# Altium schematic sheet Progr.SchDoc
size A4
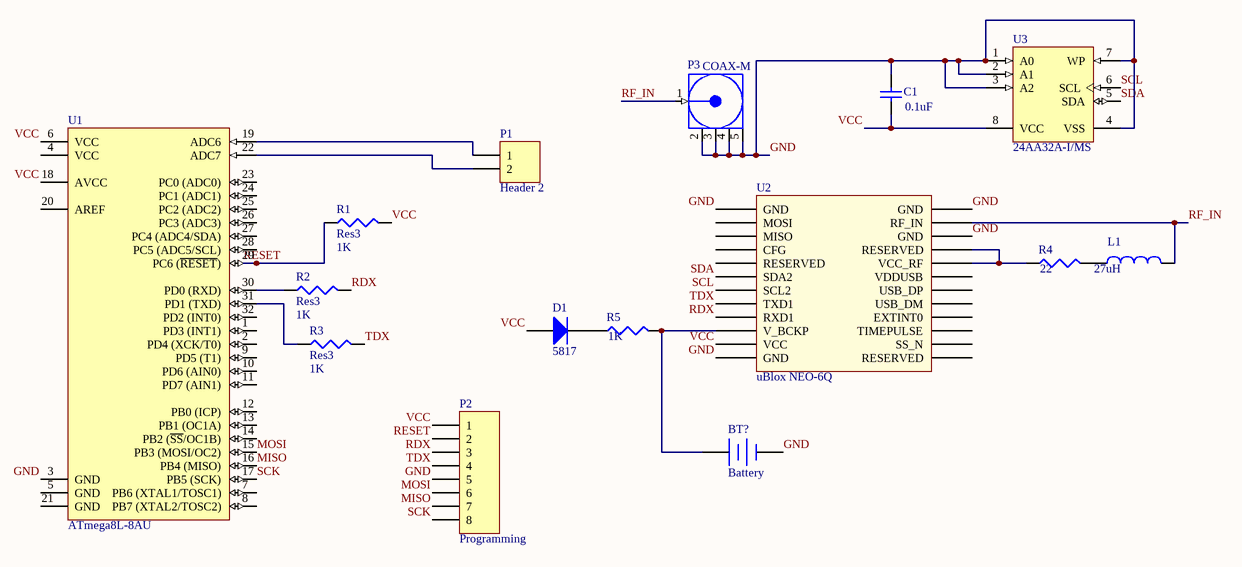
[diagram p0: Progr.SchDoc]

## Parts
BT?  Battery  [BAT-2]
C1  value 0.1uF  [C1206]  (hidden comment: Cap Semi)
D1  5817  [SMC]
L1  value 27uH  [0402-A]  (hidden comment: Inductor)
P1  Header 2  [HDR1X2]
P2  Programming  [HDR1X8]
P3  COAX-M  [MMCX2.54-V5]
R1  Res3  value 1K  [J1-0603]
R2  Res3  value 1K  [J1-0603]
R3  Res3  value 1K  [J1-0603]
R4  value 22  [J1-0603]  (hidden comment: Res3)
R5  value 1K  [J1-0603]  (hidden comment: Res3)
U1  ATmega8L-8AU  [32A_N]
U2  uBlox NEO-6Q  [NEO_6]
U3  24AA32A-I/MS  [MSOP-MS8_N]

## Nets
GND: BT?.2(-) C1.2 P2.5 P3.2(GND) P3.3(GND) P3.4(GND) P3.5(GND) U1.3(GND) U2.10(GND) U2.12(GND) U2.13(GND) U2.24(GND) U3.1(A0) U3.2(A1) U3.3(A2) U3.4(VSS) U3.7(WP)
MISO: P2.7 U1.16(PB4_(MISO))
MOSI: P2.6 U1.15(PB3_(MOSI/OC2))
RDX: P2.3 R2.2 U2.21(RXD1)
RESET: P2.2 R1.2 U1.29(PC6_(~{RESET}))
RF_IN: L1.2 P3.1(Signal) U2.11(RF_IN)
SCK: P2.8 U1.17(PB5_(SCK))
SCL: U2.19(SCL2) U3.6(SCL)
SDA: U2.18(SDA2) U3.5(SDA)
TDX: P2.4 R3.2 U2.20(TXD1)
VCC: C1.1 D1.1(A) P2.1 R1.1 U1.6(VCC) U1.18(AVCC) U2.23(VCC) U3.8(VCC)
NetBT?_1: BT?.1(+) R5.1 U2.22(V_BCKP)
NetD1_2: D1.2(K) R5.2
NetL1_1: L1.1 R4.1
NetP1_1: P1.1 U1.19(ADC6)
NetP1_2: P1.2 U1.22(ADC7)
NetR2_1: R2.1 U1.30(PD0_(RXD))
NetR3_1: R3.1 U1.31(PD1_(TXD))
NetR4_2: R4.2 U2.8(VCC_RF) U2.9(RESERVED)

Not connected (* = marked no-connect by the designer): U1 1(PD3_(INT1)) 2(PD4_(XCK/T0)) 4(VCC) 5(GND) 7(PB6_(XTAL1/TOSC1)) 8(PB7_(XTAL2/TOSC2)) 9(PD5_(T1)) 10(PD6_(AIN0)) 11(PD7_(AIN1)) 12(PB0_(ICP)) 13(PB1_(OC1A)) 14(PB2_(~{SS}/OC1B)) 20(AREF) 21(GND) 23(PC0_(ADC0)) 24(PC1_(ADC1)) 25(PC2_(ADC2)) 26(PC3_(ADC3)) 27(PC4_(ADC4/SDA)) 28(PC5_(ADC5/SCL)) 32(PD2_(INT0)); U2 1(RESERVED) 2(SS_N) 3(TIMEPULSE) 4(EXTINT0) 5(USB_DM) 6(USB_DP) 7(VDDUSB) 14(MOSI) 15(MISO) 16(CFG) 17(RESERVED)

## Library data of the parts
BT? = Battery: Multicell Battery; Published: 24-Mar-1999; LatestRevisionDate: 17-Jul-2002; LatestRevisionNote: Re-released for DXP Platform.; PackageReference: BAT-2; Publisher: Altium Limited; PackageDescription: Battery; 2 Leads
C1 = Cap Semi: Capacitor (Semiconductor SIM Model); Published: 8-Jun-2000; LatestRevisionDate: 29-May-2009; LatestRevisionNote: IPC-7351 Footprint Added.; PackageReference: C1206; Publisher: Altium Limited; PackageDescription: Chip Capacitor
D1 = Diode: Default Diode; Published: 8-Jun-2000; LatestRevisionDate: 17-Jul-2002; LatestRevisionNote: Re-released for DXP Platform.; PackageVersion: Sep-1996; PackageReference: SMC; Publisher: Altium Limited; PackageDescription: DO-214-AB/SMC; 2 C-Bend Leads; Body 7.9 x 5.9 mm, inc. leads (LxW); Code_JEDEC: DO-214-AB
L1 = Inductor: Code_IEC: 1005; Published: 8-Jun-2000; LatestRevisionDate: 29-May-2009; LatestRevisionNote: IPC-7351 Footprint Added.; PackageReference: 0402-A; Publisher: Altium Limited; PackageDescription: Chip Inductor; Code_JEITA: 0402
P1 = Header 2: Header, 2-Pin; LatestRevisionDate: 17-Jul-2002; LatestRevisionNote: Re-released for DXP Platform.; Publisher: Altium Limited
P2 = Header 8: Header, 8-Pin; LatestRevisionDate: 17-Jul-2002; LatestRevisionNote: Re-released for DXP Platform.; Publisher: Altium Limited
P3 = COAX-M: RF Coaxial PCB Connector, MMCX; Thru-Hole, Vertical Mount Plug,  50 Ohm Impedance; PackageDocument: Rev. A, 16-Jun-1997; PCB_Layout: Complies with manufacturer's recommendation.; DrillSize: Corresponds to nominal value.; Published: 15-Jul-2004; LatestRevisionDate: 15-Jul-2004; LatestRevisionNote: Component Replaced.; DatasheetDocument: 30-May-2003; PackageReference: 908-21103; Publisher: Altium Limited; ComponentLink1Description: Manufacturer Link; ComponentLink1URL: http://www.amphenolrf.com/
R1-R5 = Res3: Resistor; Published: 8-Jun-2000; LatestRevisionDate: 29-May-2009; LatestRevisionNote: IPC-7351 Footprint Added.; PackageReference: J1-0603; Publisher: Altium Limited; PackageDescription: Chip Resistor
U1 = ATmega8L-8AU: 8-bit AVR Microcontroller, 2.7-5.5V, 8MHz, 8KB Flash, 512 Bytes EEPROM, 1KB SRAM, 32-pin TQFP, Industrial Grade (-40°C to 85°C); DatasheetVersion: revZ, Feb-2011; PackageVersion: revC, Oct-2010; PackageReference: 32A; PackageDescription: 32-Lead, 7x7x1.0 mm Body, 0.8mm Lead Pitch, Thin Profile Plastic Quad Flat Package (TQFP); Code_JEDEC: MS-026-ABA; ComponentLink1Description: Manufacturer URL; ComponentLink1URL: http://www.atmel.com/; ComponentLink2Description: ATmega8(L); ComponentLink2URL: http://www.atmel.com/dyn/resources/prod_documents/doc2486.pdf; ComponentLink3Description: ATmega8(L) Summary; ComponentLink3URL: http://www.atmel.com/dyn/resources/prod_documents/2486S.pdf
U3 = 24AA32A-I/MS: 32Kbit, 400kHz, 1.7V, I2C Serial EEPROM, 8-Pin MSOP, Industrial Temperature; Manufacturer: Microchip; DatasheetVersion: revJ, Feb-2009; PackageVersion: revBB, Aug-2009; PackageReference: MSOP-MS8; PackageDescription: 8-Lead Plastic Micro Small Outline Package (MS) [MSOP]; Supplier 1: Digi-Key; Supplier Part Number 1: 24AA32A-I/MS-ND; Supplier 2: Farnell; Supplier Part Number 2: 1331296; Supplier 3: Newark; Supplier Part Number 3: 40C2562; Supplier 4: Mouser; Supplier Part Number 4: 579-24AA32A-I/MS; Mounting Technology: Surface Mount; PartNumber: 24AA32A-I/MS; ComponentLink1Description: Manufacturer URL; ComponentLink1URL: http://www.microchip.com/; ComponentLink2Description: Datasheet; ComponentLink2URL: http://ww1.microchip.com/downloads/en/DeviceDoc/21713J.pdf; ComponentLink3Description: Package Specification; ComponentLink3URL: http://www.microchip.com/stellent/groups/techpub_sg/documents/packagingspec/en012702.pdf